# Altium project 双键灯.PrjPcb
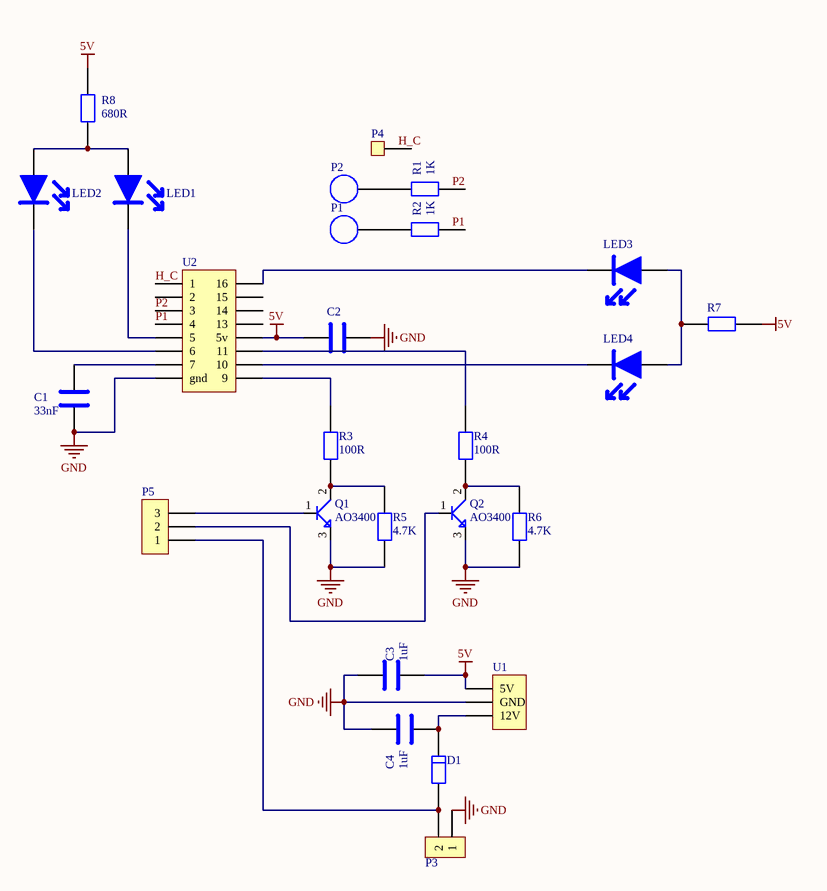
[diagram p0: 双键灯.SchDoc]
1 sheet, 26 parts. Net scope: global (net labels, ports and power ports of the same name join across sheets).
Board file: 双键灯.PcbDoc

## Sheet 双键灯.SchDoc
size A4

### Parts
C1  33nF  [C0603]
C2  cap  [C0603]  (value not drawn)
C3  1uF  [C0603]
C4  1uF  [C0603]
D1  sod  [SOD123]  (value not drawn)
LED1  led  [3806(020LED)]  (value not drawn)
LED2  led  [3806(020LED)]  (value not drawn)
LED3  led  [3806(020LED)]  (value not drawn)
LED4  led  [3806(020LED)]  (value not drawn)
P1  T_PAD  [TOUCH_PAD]  (value not drawn)
P2  T_PAD  [TOUCH_PAD]  (value not drawn)
P3  pad2  [PAD_2 _ab]  (value not drawn)
P4  pad1  [PAD]  (value not drawn)
P5  pad3  [PAD*3]  (value not drawn)
Q1  AO3400  [TO-252]
Q2  AO3400  [TO-252]
R1  1K  [R0603]
R2  1K  [R0603]
R3  100R  [R0603]
R4  100R  [R0603]
R5  4.7K  [R0603]
R6  4.7K  [R0603]
R7  680R  [R0603]  (value not drawn)
R8  680R  [R0603]
U1  u2  [SOT-89]  (value not drawn)
U2  u  [SOP16]  (value not drawn)

### Nets
5V: C2.1 C3.2 R7.1 R8.1 U1.1(5V) U2.12(5v)
GND: C1.1 C2.2 C3.1 C4.1 P3.1 Q1.3 Q2.3 R5.1 R6.1 U1.2(GND) U2.8(gnd)
H_C: U2.1
P1: U2.4
P2: U2.3
NetC1_2: C1.2 U2.7
NetC4_2: C4.2 D1.2 U1.3(12V)
NetD1_1: D1.1 P3.2 P5.1
NetLED1_A: LED1.A LED2.A R8.2
NetLED1_K: LED1.K U2.5
NetLED2_K: LED2.K U2.6
NetLED3_A: LED3.A LED4.A R7.2
NetLED3_K: LED3.K U2.16
NetLED4_K: LED4.K U2.10
NetP1_4: P1.4 R2.2
NetP2_4: P2.4 R1.2
NetP5_2: P5.2 Q2.1
NetP5_3: P5.3 Q1.1
NetQ1_2: Q1.2 R3.1 R5.2
NetQ2_2: Q2.2 R4.1 R6.2
NetR3_2: R3.2 U2.9
NetR4_2: R4.2 U2.11

Not connected (* = marked no-connect by the designer): P4 1; R1 1; R2 1; U2 2 13 14 15

### Notes on the sheet
- Labels drawn without touching a wire or pin: H_C, P1, P2

### Library data of the parts
C1 C3 C4 = cap
Q1 Q2 = pnp
R1-R8 = res